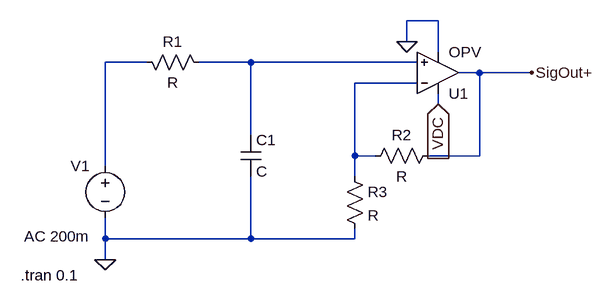
[diagram p0: schematic ESBBBaktiv.asc]
ESBBBaktiv.asc, the LTspice schematic file:
Version 4
SHEET 1 880 680
WIRE 576 -64 528 -64
WIRE 528 -32 528 -64
WIRE 576 -16 576 -64
WIRE 128 0 64 0
WIRE 288 0 208 0
WIRE 544 0 288 0
WIRE 640 16 608 16
WIRE 720 16 640 16
WIRE 544 32 448 32
WIRE 576 64 576 48
WIRE 288 112 288 0
WIRE 448 144 448 32
WIRE 480 144 448 144
WIRE 640 144 640 16
WIRE 640 144 560 144
WIRE 64 160 64 0
WIRE 448 176 448 144
WIRE 64 272 64 240
WIRE 288 272 288 176
WIRE 288 272 64 272
WIRE 448 272 448 256
WIRE 448 272 288 272
WIRE 64 304 64 272
FLAG 64 304 0
FLAG 528 -32 0
FLAG 576 64 VDC
IOPIN 576 64 In
FLAG 720 16 SigOut+
SYMBOL voltage 64 144 M0
WINDOW 123 24 124 Left 2
WINDOW 39 0 0 Left 0
SYMATTR InstName V1
SYMATTR Value ""
SYMATTR Value2 AC 200m
SYMBOL cap 272 112 R0
SYMATTR InstName C1
SYMBOL OpAmps\\opamp2 576 80 M180
SYMATTR InstName U1
SYMATTR Value OPV
SYMBOL res 464 160 R270
WINDOW 0 32 56 VTop 2
WINDOW 3 0 56 VBottom 2
SYMATTR InstName R2
SYMBOL res 432 160 R0
SYMATTR InstName R3
SYMBOL res 112 -16 M90
WINDOW 0 0 56 VBottom 2
WINDOW 3 32 56 VTop 2
SYMATTR InstName R1
TEXT -66 328 Left 2 !.tran 0.1

The netlist it stands for:
* ESBBBaktiv.asc
V1 N001 0 AC 200m
C1 N002 0 C
XU1 N002 N003 VDC 0 SigOut+ OPV  ; pins In+ In- V+ V- OUT
R2 N003 SigOut+ R
R3 N003 0 R
R1 N001 N002 R
.tran 0.1
.backanno
.end